# EAGLE design AlphaNumeric Featherwing rev A (EAGLE 6.6.0)
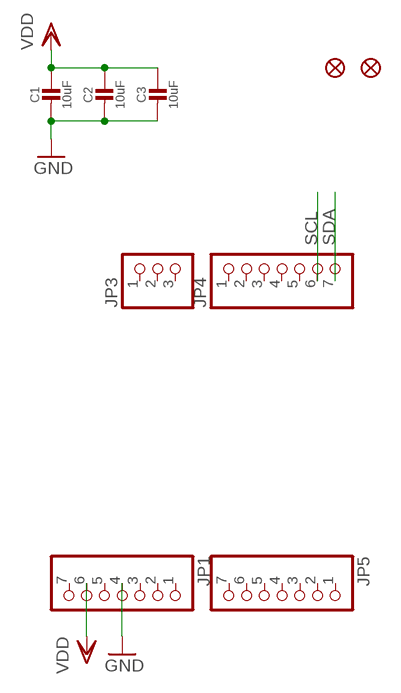
[diagram p0: schematic, sheet 1, part 1 of 2]
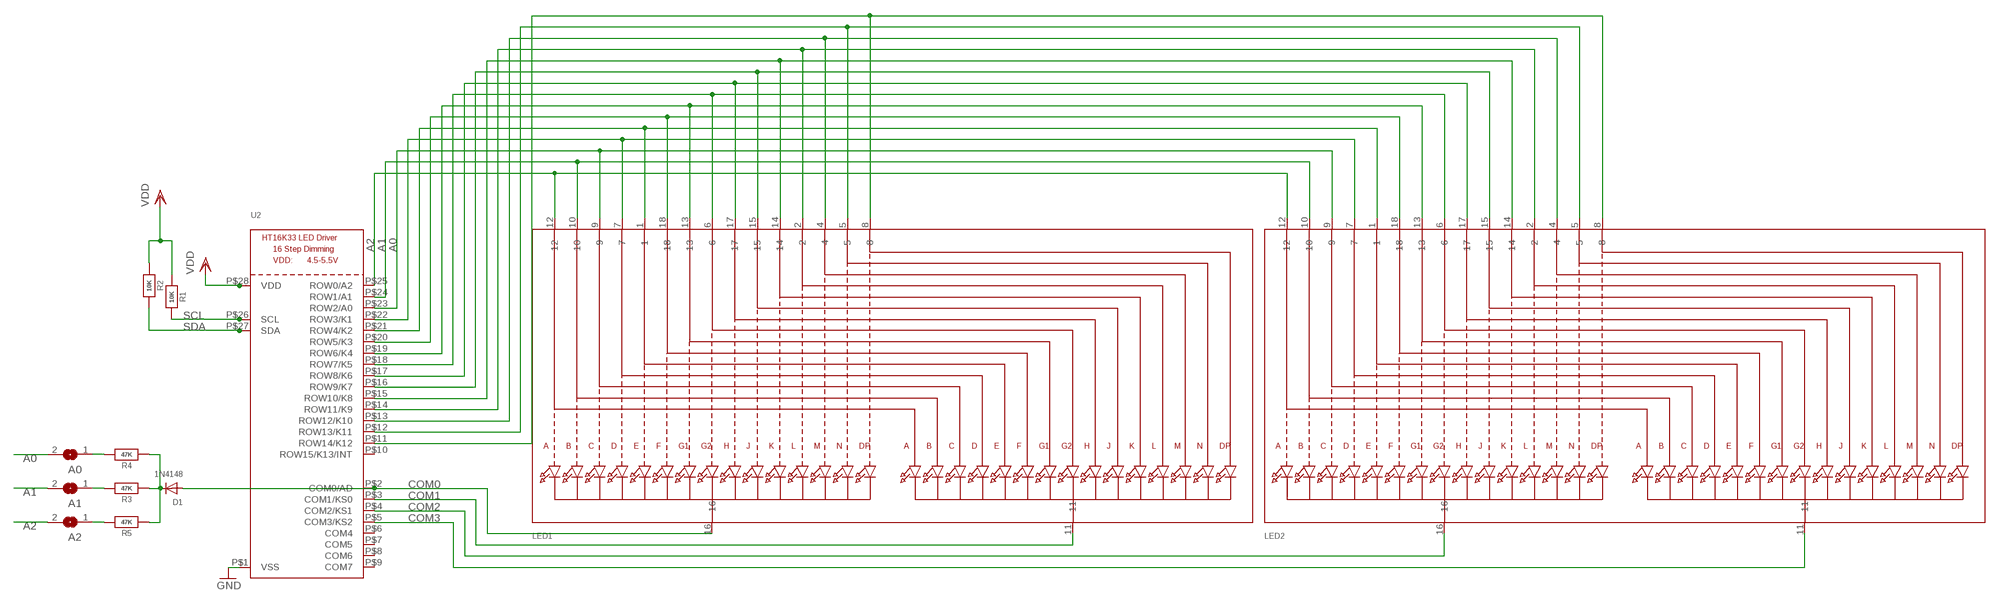
[diagram p1: schematic, sheet 1, part 2 of 2]

## Parts
A0  SOLDERJUMPERREFLOW_NOPASTE  [SOLDERJUMPER_REFLOW_NOPASTE]
A1  SOLDERJUMPERREFLOW_NOPASTE  [SOLDERJUMPER_REFLOW_NOPASTE]
A2  SOLDERJUMPERREFLOW_NOPASTE  [SOLDERJUMPER_REFLOW_NOPASTE]
C1  10uF  CAP_CERAMIC0805-NOOUTLINE  [0805-NO]
C2  10uF  CAP_CERAMIC0805-NOOUTLINE  [0805-NO]
C3  10uF  CAP_CERAMIC0805-NOOUTLINE  [0805-NO]
D1  1N4148  DIODESOD-323F  [SOD-323F]
JP1  HEADER-1X770MIL  [1X07_ROUND_70]
JP3  HEADER-1X3ROUND  [1X03_ROUND]
JP4  HEADER-1X770MIL  [1X07_ROUND_70]
JP5  HEADER-1X770MIL  [1X07_ROUND_70]
LED1  DISP_SEGMENT_STARBURST_DUAL_COMMONCATHODE  [SEGMENT_STARTBUST_DUAL_KWA-541CBB]
LED2  DISP_SEGMENT_STARBURST_DUAL_COMMONCATHODE  [SEGMENT_STARTBUST_DUAL_KWA-541CBB]
R1  10K  RESISTOR0805_NOOUTLINE  [0805-NO]
R2  10K  RESISTOR0805_NOOUTLINE  [0805-NO]
R3  47K  RESISTOR0805_NOOUTLINE  [0805-NO]
R4  47K  RESISTOR0805_NOOUTLINE  [0805-NO]
R5  47K  RESISTOR0805_NOOUTLINE  [0805-NO]
U2  HT16K33_SOP28_SKINNY  [SOP28_300MIL_SKINNY]
U$1  FIDUCIAL""  [FIDUCIAL_1MM]
U$2  FIDUCIAL""  [FIDUCIAL_1MM]

## Nets
A0: A0.2 LED1.9 LED2.9 U2.P$23(ROW2/A0)
A1: A1.2 LED1.10 LED2.10 U2.P$24(ROW1/A1)
A2: A2.2 LED1.12 LED2.12 U2.P$25(ROW0/A2)
COM0: D1.A LED1.16 U2.P$2(COM0/AD)
COM1: LED1.11 U2.P$3(COM1/KS0)
COM2: LED2.16 U2.P$4(COM2/KS1)
COM3: LED2.11 U2.P$5(COM3/KS2)
GND: C1.2 C2.2 C3.2 JP1.4 U2.P$1(VSS)
N$1: D1.C R3.1 R4.1 R5.1
N$4: LED1.17 LED2.17 U2.P$17(ROW8/K6)
N$5: LED1.15 LED2.15 U2.P$16(ROW9/K7)
N$6: LED1.14 LED2.14 U2.P$15(ROW10/K8)
N$7: A2.1 R5.2
N$8: LED1.2 LED2.2 U2.P$14(ROW11/K9)
N$9: LED1.4 LED2.4 U2.P$13(ROW12/K10)
N$10: LED1.7 LED2.7 U2.P$22(ROW3/K1)
N$11: LED1.1 LED2.1 U2.P$21(ROW4/K2)
N$12: LED1.18 LED2.18 U2.P$20(ROW5/K3)
N$13: LED1.13 LED2.13 U2.P$19(ROW6/K4)
N$14: LED1.5 LED2.5 U2.P$12(ROW13/K11)
N$15: LED1.8 LED2.8 U2.P$11(ROW14/K12)
N$16: LED1.6 LED2.6 U2.P$18(ROW7/K5)
N$19: A1.1 R3.2
N$20: A0.1 R4.2
SCL: JP4.6 R1.2 U2.P$26(SCL)
SDA: JP4.7 R2.2 U2.P$27(SDA)
VDD: C1.1 C2.1 C3.1 JP1.6 R1.1 R2.1 U2.P$28(VDD)
Unconnected: JP1.1 JP1.2 JP1.3 JP1.5 JP1.7 JP3.1 JP3.2 JP3.3 JP4.1 JP4.2 JP4.3 JP4.4 JP4.5 JP5.1 JP5.2 JP5.3 JP5.4 JP5.5 JP5.6 JP5.7 U2.P$6(COM4) U2.P$7(COM5) U2.P$8(COM6) U2.P$9(COM7) U2.P$10(ROW15/K13/INT)

## Library data of the parts
A0 A1 A2 = microbuilder:SOLDERJUMPER: SMD Solder JUMPER Solder the two pads together to create a connection, or remove the solder to break it. REFLOW - Use this footprint for solder paste and reflow ovens. WAVE - Use this footprint for hand-soldering (larger pads). CLOSED - Has a trace between the two pads to ensure it is closed by default. The trace needs to be cut to disable the jumper, and can be closed again by creating a solder bridge between the two pads.
C1-C3 = microbuilder:CAP_CERAMIC: Ceramic Capacitors For new designs, use the packages preceded by an '_' character since they are more reliable: The following footprints should be used on most boards: _0402 - Standard footprint for regular board layouts _0603 - Standard footprint for regular board layouts _0805 - Standard footprint for regular board layouts _1206 - Standard footprint for regular board layouts For extremely tight-pitch boards where space is at a premium, the following 'micro-pitch' footprints can be used (smaller pads, no silkscreen outline, etc.): _0402MP - Micro-pitch footprint for very dense/compact boards _0603MP - Micro-pitch footprint for very dense/compact boards _0805MP - Micro-pitch footprint for very dense/compact boards _1206MP - Micro-pitch footprint for very dense/compact boards
D1 = adafruit:DIODE: Diode SMADIODE - SMA Surface Mount Package 20V 1A Schottky Diode Digikey: 641-1014-6-ND DO-1N4148 - Through Hole Small Current Diode SOD-123 20V 1 A (.5mV Vf) Schottky Diode - Digikey: MBRX120TPMSCT-ND SOD-323 10V 570mA (.38mV Vf, 3ns) Schottky Diode - Digikey: ZLLS410CT-ND SOD-523 30V 30mA Schottky Diode (RB751S-40TE61) - Digikey: RB751S-40TE61CT-ND SOT23-R/W - SOT23 Package (R = Solder Paste/Reflow Ovens, W = Hand-Soldering) BAT54Film 40V 300mA - Digikey: 497-7162-1-ND
JP1 JP4 JP5 = microbuilder:HEADER-1X7: PIN HEADER
JP3 = microbuilder:HEADER-1X3: PIN HEADER
LED1 LED2 = microbuilder:DISP_SEGMENT_STARBURST_DUAL_COMMONCATHODE: 2 x Starburst Segment Displays - Common Cathode Luckylight KWA-541CBB
R1-R5 = microbuilder:RESISTOR: Resistors For new designs, use the packages preceded by an '_' character since they are more reliable: The following footprints should be used on most boards: _0402 - Standard footprint for regular board layouts _0603 - Standard footprint for regular board layouts _0805 - Standard footprint for regular board layouts _1206 - Standard footprint for regular board layouts For extremely tight-pitch boards where space is at a premium, the following 'micro-pitch' footprints can be used (smaller pads, no silkscreen outline, etc.): _0402MP - Micro-pitch footprint for very dense/compact boards _0603MP - Micro-pitch footprint for very dense/compact boards _0805MP - Micro-pitch footprint for very dense/compact boards _1206MP - Micro-pitch footprint for very dense/compact boards
U2 = microbuilder:HT16K33_SOP28
U$1 U$2 = microbuilder:FIDUCIAL: Fiducial Alignment Points Various fiducial points for machine vision alignment.; BOM: EXCLUDE

## Board
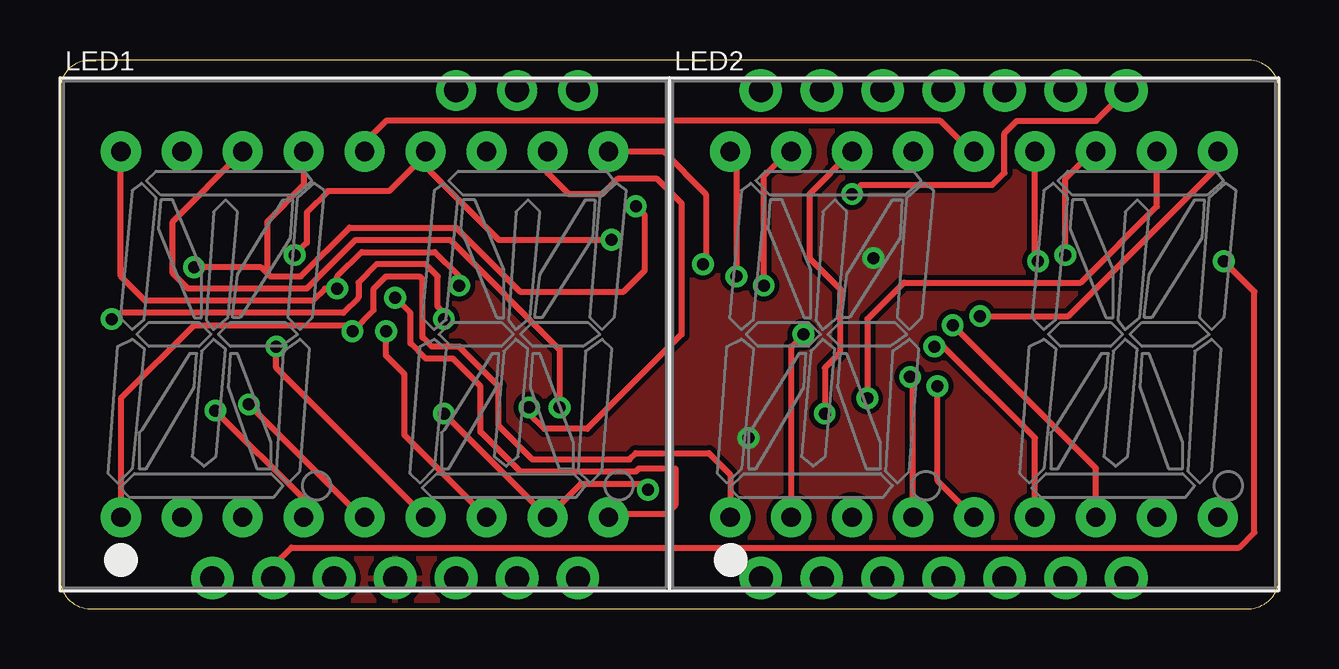
[diagram p2: board, top side]
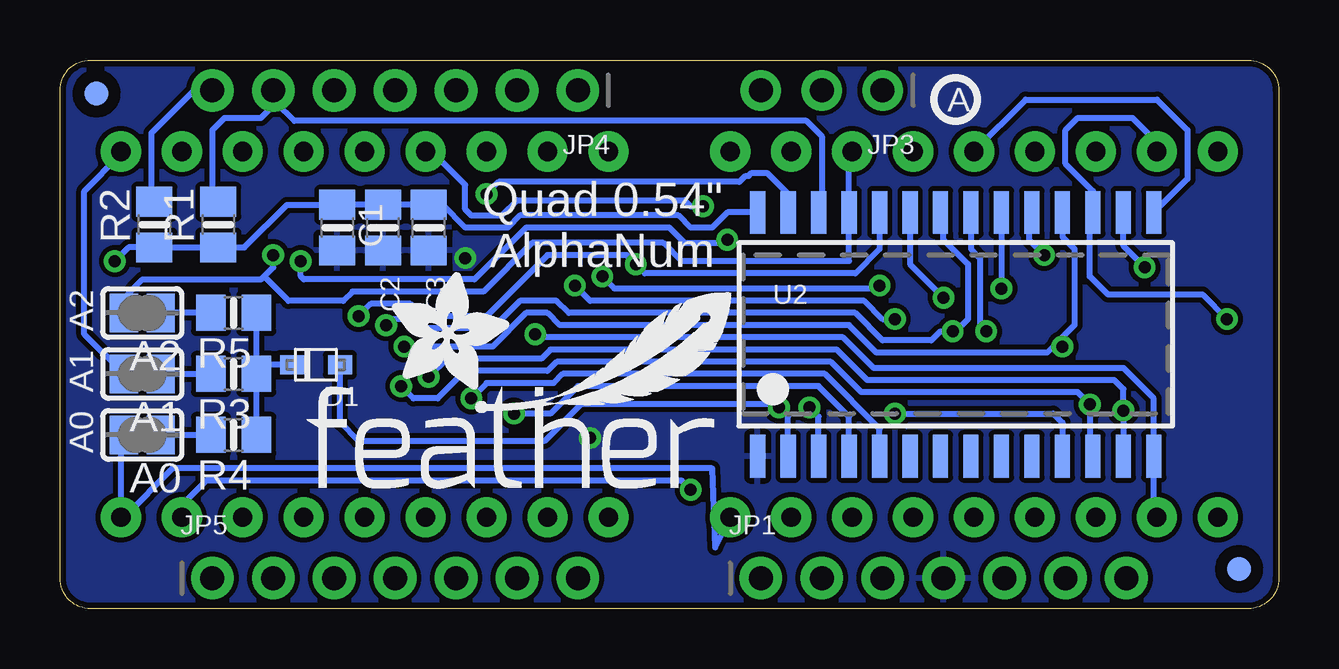
[diagram p3: board, bottom side, seen from below]

Size 50.8 x 22.86 mm. Coordinates in mm from the lower left corner, seen from the top.
Outline: 49.53,22.86 1.27,22.86 arc90 0,21.59 0,1.27 arc90 1.27,0 49.53,0 arc90 50.8,1.27 50.8,21.59 arc90 49.53,22.86
Copper layers (1*16): Top 0.035mm / dielectric 1.5mm / Bottom 0.035mm
Design rules "adafruit *": minimum track width 8mil, minimum drill 15.5mil, track to track 8mil, track to pad 8mil, pad to pad 8mil, via to via 8mil, smd to smd 8mil, copper to edge 10mil, drill to drill 8mil, minimum pad ring 10mil, minimum via ring 8mil, stop-mask expansion 2mil, vias tented up to drill 20mil, thermal gap 10mil

### Footprints (pad centres in the part's own frame; a part is rotated, then mirrored left to right if it is on the bottom)
SOLDERJUMPER_REFLOW_NOPASTE = smd 1.168 x 1.6: 1 -0.762,0; 2 0.762,0
0805-NO = smd 1.24 x 1.5: 1 -0.95,0; 2 0.95,0
SOD-323F = smd 1 x 0.8: A -1,0; C 1,0
1X07_ROUND_70 = drill 1 pad 1.778: 1 -7.62,0; 2 -5.08,0; 3 -2.54,0; 4 0,0; 5 2.54,0; 6 5.08,0; 7 7.62,0
1X03_ROUND = drill 1 pad 1.676: 1 -2.54,0; 2 0,0; 3 2.54,0
SEGMENT_STARTBUST_DUAL_KWA-541CBB = drill 0.8 pad 1.676: 1 -10.16,-7.62; 2 -7.62,-7.62; 3 -5.08,-7.62; 4 -2.54,-7.62; 5 0,-7.62; 6 2.54,-7.62; 7 5.08,-7.62; 8 7.62,-7.62; 9 10.16,-7.62; 10 10.16,7.62; 11 7.62,7.62; 12 5.08,7.62; 13 2.54,7.62; 14 0,7.62; 15 -2.54,7.62; 16 -5.08,7.62; 17 -7.62,7.62; 18 -10.16,7.62
SOP28_300MIL_SKINNY = smd 0.635 x 1.778: P$1 -8.255,-5.08; P$2 -6.985,-5.08; P$3 -5.715,-5.08; P$4 -4.445,-5.08; P$5 -3.175,-5.08; P$6 -1.905,-5.08; P$7 -0.635,-5.08; P$8 0.635,-5.08; P$9 1.905,-5.08; P$10 3.175,-5.08; P$11 4.445,-5.08; P$12 5.715,-5.08; P$13 6.985,-5.08; P$14 8.255,-5.08; P$15 8.255,5.08; P$16 6.985,5.08; P$17 5.715,5.08; P$18 4.445,5.08; P$19 3.175,5.08; P$20 1.905,5.08; P$21 0.635,5.08; P$22 -0.635,5.08; P$23 -1.905,5.08; P$24 -3.175,5.08; P$25 -4.445,5.08; P$26 -5.715,5.08; P$27 -6.985,5.08; P$28 -8.255,5.08
FIDUCIAL_1MM = smd 1 x 1: 1 0,0

### Placement (x,y rotation side)
A0  47.37,7.24 180 bottom
A1  47.37,9.78 180 bottom
A2  47.37,12.32 180 bottom
C1  39.24,15.88 270 bottom
C2  37.34,15.88 270 bottom
C3  35.43,15.88 270 bottom
D1  40.13,10.16 180 bottom
JP1  13.97,1.27 0 bottom
JP3  19.05,21.59 180 bottom
JP4  36.83,21.59 180 bottom
JP5  36.83,1.27 0 bottom
LED1  12.7,11.43 0 top
LED2  38.1,11.43 0 top
R1  44.2,16 90 bottom
R2  46.86,16 90 bottom
R3  43.56,9.78 180 bottom
R4  43.56,7.24 180 bottom
R5  43.56,12.32 180 bottom
U2  13.46,11.43 0 bottom
U$1  1.65,1.65 0 bottom
U$2  49.28,21.46 0 bottom
U$3  [PCBFEAT-REV-040]  13.46,21.21 0 bottom
U$4  [FEATHERLOGO_MED]  40.64,4.95 0 bottom
U$5  [ADAFRUIT_5MM]  36.96,9.14 0 bottom

### Tracks (layer width: path | path; a pad name or v marks a point on that pad's centre or on a via)
A0  (via drill 0.5)
  Top 0.254: LED1.9 22.86,3.94 25.27,3.94 25.65,4.32 25.65,5.84 24.13,5.84 24,5.71 19.18,5.71 17.53,7.37 17.53,9.27 16.38,10.41 15.24,10.41 14.6,11.05 14.6,12.32 v13.97,12.95
  Bottom 0.254: 48.13,3.94 LED2.9 | A0.2 48.26,7.11 LED2.9 | LED2.9 48.13,3.81 46.1,5.84 23.62,5.84 23.49,2.54 LED1.9 | U2.P$23 15.37,14.35 v13.97,12.95
A1  (via drill 0.5)
  Top 0.254: v38.35,12.19 42.04,12.19 48.26,18.41 LED2.10 | LED1.10 25.15,19.05 26.92,17.27 26.92,14.48 v26.8,14.35
  Bottom 0.254: U2.P$24 16.64,14.99 17.65,13.97 26.42,13.97 v26.8,14.35 27.18,14.73 30.48,14.73 33.02,12.19 35.69,12.19 36.2,12.7 37.85,12.7 v38.35,12.19 | A1.2 49.78,11.43 49.78,17.4 48.26,18.92 LED2.10
A2  (via drill 0.5)
  Top 0.254: v41.91,14.73 41.91,17.91 43.05,19.05 LED2.12
  Bottom 0.254: A2.2 48.13,12.95 47.37,13.72 42.42,13.72 42.29,13.84 | 42.29,13.84 41.91,14.22 v41.91,14.73 | LED1.12 17.91,18.92 U2.P$25 17.91,14.48 24.89,14.48 25.65,15.24 31.11,15.24 33.15,13.21 38.61,13.21 38.99,12.83 41.27,12.83 42.29,13.84
COM0  (via drill 0.5)
  Top 0.254: LED1.16 4.7,16.13 4.7,13.97 5.33,13.33 10.29,13.33 12.32,15.37 16.26,15.37 20.83,10.79 v20.83,8.38
  Bottom 0.254: 39.13,9.41 D1.A 39.13,7.76 38.35,6.98 30.61,6.98 29.08,8.51 20.83,8.51 v20.83,8.38 20.45,8 U2.P$2
COM1  (via drill 0.5)
  Top 0.254: LED1.11 20.32,18.16 21.21,17.27 22.61,17.27 23.24,17.91 24.89,17.91 25.91,16.89 25.91,11.43 21.97,7.49 20.19,7.49 19.56,8.13 v19.56,8.38
  Bottom 0.254: U2.P$3 19.18,8 v19.56,8.38
COM2  (via drill 0.5)
  Top 0.254: LED2.16 31.24,17.27 31.24,14.61 32.51,13.33 32.51,10.67 31.88,10.03 v31.88,8.13
  Bottom 0.254: U2.P$4 17.91,8 19.18,9.27 29.21,9.27 30.35,8.13 v31.88,8.13
COM3  (via drill 0.5)
  Top 0.254: v33.66,8.76 33.66,12.06 35.18,13.59 42.55,13.59 45.72,16.76 LED2.11
  Bottom 0.254: U2.P$5 16.64,7.49 18.92,9.78 29.84,9.78 30.23,9.4 33.02,9.4 v33.66,8.76 33.53,8.76
GND  (via drill 0.5)
  other vias: 33.91,14.61 28.7,7.11
  pour Bottom: 50.8,22.86 50.8,0 0,0 0,22.86
  pour Top: 50.8,22.86 50.8,0 0,0 0,22.86
N$1
  Bottom 0.254: R4.1 R3.1 | R3.1 R5.1 | D1.C 42.23,10.16 R3.1
N$4  (via drill 0.5)
  Top 0.254: v29.34,13.46 29.34,18.03 30.35,19.05 LED2.17 | v2.16,12.06 2.29,12.06 2.54,12.32 11.81,12.32 12.45,12.95 12.45,13.59 13.21,14.35 15.24,14.35 15.75,13.84 15.75,12.57 16,12.32 v16,12.06
  Bottom 0.254: v29.34,13.46 28.7,12.83 17.27,12.83 16.51,12.06 v16,12.06 | v2.16,12.06 3.17,13.08 7.11,13.08 7.87,13.84 7.87,16.38 U2.P$17 7.75,17.4 8.89,18.54 8.89,19.94 8.38,20.45 6.1,20.45 5.08,19.43 LED1.17
N$5  (via drill 0.5)
  Top 0.254: v5.59,14.22 8.38,14.22 8.64,13.97 | v24,16.76 24.38,16.38 24.38,14.1 23.49,13.21 19.18,13.21 16.51,15.88 12.06,15.88 10.03,13.84 8.76,13.84 8.64,13.97 | LED1.15 10.16,17.65 8.64,16.13 8.64,13.97
  Bottom 0.254: v5.59,14.22 6.48,15.11 U2.P$16 | v24,16.76 24.51,16.76 24.76,17.02 31.75,17.02 32.38,16.38 33.66,16.38 33.91,16.64 33.91,17.65 35.31,19.05 LED2.15
N$6
  Top 0.254: LED1.14 12.7,19.43 13.59,20.32 36.7,20.32 37.97,19.05 LED2.14
  Bottom 0.254: LED1.14 10.54,21.21 5.08,21.21 3.81,19.94 3.81,17.91 U2.P$15
N$7
  Bottom 0.254: R5.2 A2.1
N$8  (via drill 0.5)
  Top 0.254: LED2.2 30.48,10.92 v30.99,11.43
  Bottom 0.254: LED1.2 5.21,3.81 U2.P$14 5.21,8.76 6.48,10.03 16.89,10.03 18.16,11.3 30.86,11.3 v30.99,11.43
N$9  (via drill 0.5)
  Top 0.254: v6.48,8.25 10.16,4.57 LED1.4 | LED2.4 35.56,9.53 v35.43,9.65
  Bottom 0.254: U2.P$13 v6.48,8.25 6.48,9.14 6.86,9.53 17.14,9.53 18.41,10.79 30.35,10.79 30.73,10.41 34.67,10.41 v35.43,9.65 35.31,9.65
N$10  (via drill 0.5)
  Top 0.254: LED2.7 43.18,5.84 v37.21,11.81 | v13.59,11.56 13.59,10.54 14.35,9.78 14.35,7.24 LED1.7
  Bottom 0.254: U2.P$22 13.97,16.38 13.97,15.37 12.95,14.35 12.95,12.06 13.46,11.56 v13.59,11.56 14.1,11.56 14.48,11.18 16.51,11.18 17.65,12.32 29.59,12.32 30.1,12.83 31.62,12.83 32.77,11.68 35.94,11.68 36.32,12.06 36.96,12.06 v37.21,11.81
N$11  (via drill 0.5)
  Top 0.254: LED2.1 27.94,5.59 27.05,6.48 24,6.48 23.75,6.22 19.68,6.22 18.29,7.62 18.29,9.27 16.64,10.92 15.49,10.92 15.11,11.3 15.11,13.72 14.99,13.84 13.59,13.84 13.08,13.33 13.08,12.45 v12.19,11.56 12.19,11.68 12.06,11.81 5.59,11.81 2.54,8.76 LED1.1
  Bottom 0.254: U2.P$21 12.83,14.99 12.45,14.61 12.45,11.81 v12.19,11.56
N$12  (via drill 0.5)
  Top 0.254: v16.64,13.46 16.64,13.84 15.62,14.86 12.57,14.86 11.56,13.84 v11.56,13.33 11.05,13.33 10.54,12.83 3.56,12.83 2.54,13.84 LED1.18 | LED2.18 28.19,18.8 v28.19,13.84
  Bottom 0.254: U2.P$20 v11.56,13.33 | v28.19,13.84 27.69,13.33 16.89,13.33 16.76,13.46 v16.64,13.46
N$13  (via drill 0.5)
  Top 0.254: v22.99,15.37 18.29,15.37 15.11,18.54 15.11,18.92 LED1.13 14.99,18.8 14.99,18.67 13.72,17.4 11.18,17.4 U2.P$19 10.29,15.24 v9.78,14.73 | v40.77,14.48 40.64,14.61 LED2.13
  Bottom 0.254: U2.P$19 10.41,16.38 10.41,15.37 v9.78,14.73 | v22.99,15.37 23.11,15.24 24.76,15.24 25.4,15.88 31.37,15.88 33.53,13.72 40.64,13.72 40.77,13.84 v40.77,14.48
N$14  (via drill 0.5)
  Top 0.254: LED2.5 36.58,5.33 v36.58,9.27 | LED1.5 12.57,3.81 v7.87,8.51
  Bottom 0.254: U2.P$12 7.87,6.48 v7.87,8.51 8.38,9.02 17.4,9.02 18.67,10.29 30.1,10.29 30.48,9.91 33.91,9.91 35.05,8.76 36.07,8.76 v36.58,9.27
N$15  (via drill 0.5)
  Top 0.254: v24.51,4.95 24.26,5.21 21.72,5.21 LED1.8 v16,8.13
  Bottom 0.254: v24.51,4.95 24.89,5.33 44.7,5.33 45.72,4.32 LED2.8 | v16,8.13 9.4,8.13 9.02,7.75 U2.P$11
N$16  (via drill 0.5)
  Top 0.254: 40.64,3.94 LED2.6 40.64,7.11 36.83,10.92 v36.45,10.92 | LED1.6 9.02,10.03 v9.02,10.92
  Bottom 0.254: U2.P$18 9.02,15.49 8.51,14.99 8.51,11.81 9.02,11.3 | 9.02,11.3 v9.02,10.92 | 9.02,11.3 9.65,10.67 16.76,10.67 17.91,11.81 29.97,11.81 30.48,12.32 31.37,12.32 32.77,10.92 v36.45,10.92
N$19
  Bottom 0.254: A1.1 R3.2
N$20
  Bottom 0.254: A0.1 R4.2
SCL
  Bottom 0.254: 41.78,21.08 41.02,20.32 19.68,20.32 19.05,19.69 19.05,16.51 U2.P$26 | 41.78,21.08 41.91,21.21 JP4.6 | 41.78,21.08 42.42,20.45 43.94,20.45 44.45,19.94 44.45,17.46 44.2,17.21 R1.2
SDA  (via drill 0.5)
  Top 0.254: v33.02,17.27 33.4,17.65 38.86,17.65 39.37,18.16 39.37,19.81 39.88,20.32 43.18,20.32 JP4.7
  Bottom 0.254: U2.P$27 20.32,16.64 20.32,17.14 21.34,18.16 21.97,18.16 22.1,18.03 22.22,18.03 22.48,17.78 32.51,17.78 v33.02,17.27 | JP4.7 45.21,21.59 46.99,19.81 46.99,16.95 R2.2 46.86,16.57
VDD  (via drill 0.5)
  Top 0.254: JP1.6 8.89,1.78 9.65,2.54 49.15,2.54 49.78,3.17 49.78,13.21 v48.51,14.48
  Bottom 0.254: U2.P$28 22.99,16.51 23.62,15.88 24.51,15.88 25.02,16.38 31.62,16.38 32.13,15.88 33.91,15.88 34.86,16.82 C3.1 C2.1 C1.1 41.34,16.82 43.11,15.05 R1.1 R2.1 47.94,15.05 v48.51,14.48

### Text on the board
bPlace: Quad 0.54" / AlphaNum | A2 | A1 | A0